# EAGLE design ai_orb-8 (EAGLE 7.1.0)
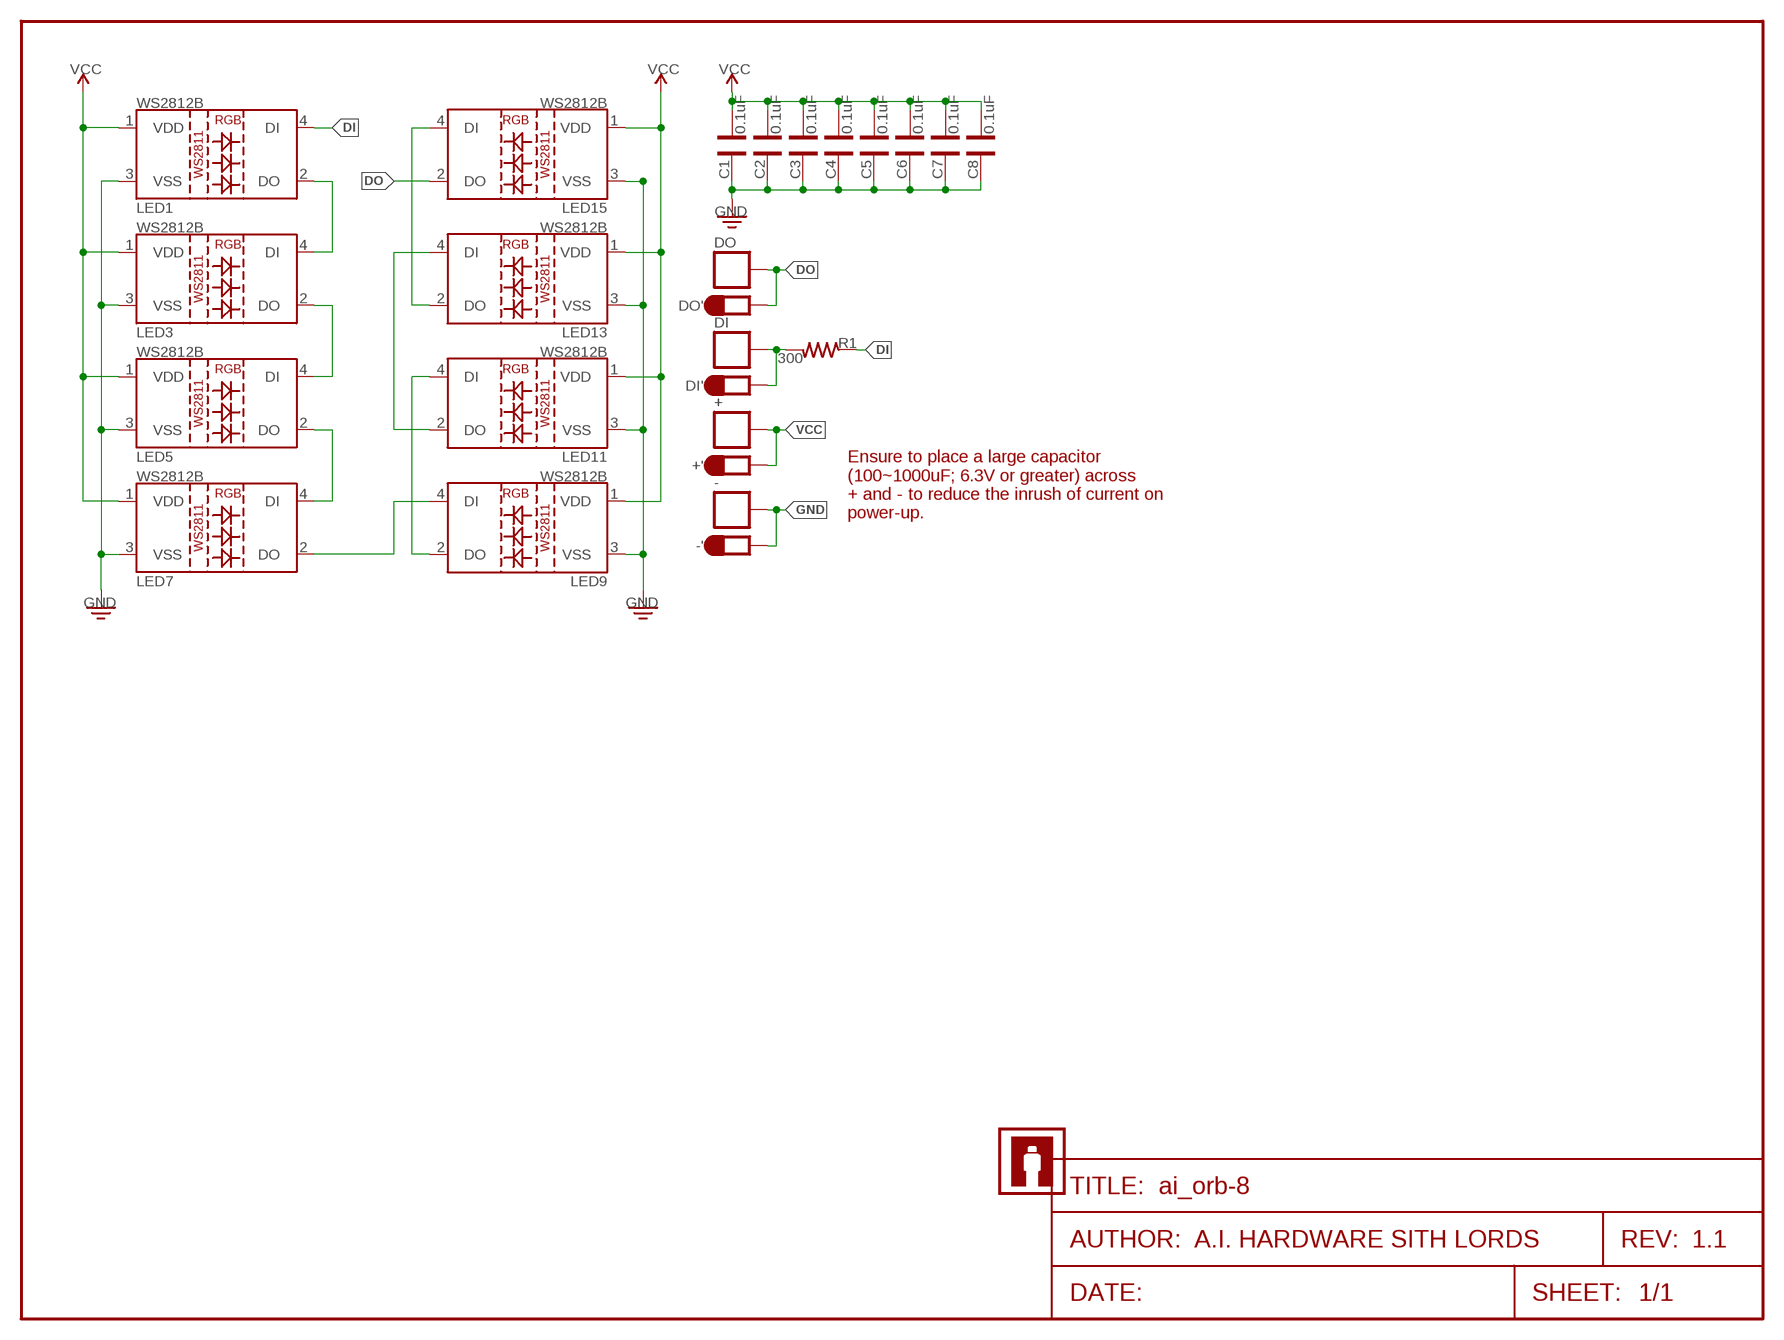
[diagram p0: schematic, sheet 1]
FRAME1 (FRAME-LETTER): AUTHOR: A.I. HARDWARE SITH LORDS; REV: 1.1

## Parts
+  1X01-SM  [1X01-SM]
+'  1X01-PETAL  [1X01-PETAL]
-  1X01-SM  [1X01-SM]
-'  1X01-PETAL  [1X01-PETAL]
C1  0.1uF  CAP0402  [CAP-0402]
C2  0.1uF  CAP0402  [CAP-0402]
C3  0.1uF  CAP0402  [CAP-0402]
C4  0.1uF  CAP0402  [CAP-0402]
C5  0.1uF  CAP0402  [CAP-0402]
C6  0.1uF  CAP0402  [CAP-0402]
C7  0.1uF  CAP0402  [CAP-0402]
C8  0.1uF  CAP0402  [CAP-0402]
DI  1X01-SM  [1X01-SM]
DI'  1X01-PETAL  [1X01-PETAL]
DO  1X01-SM  [1X01-SM]
DO'  1X01-PETAL  [1X01-PETAL]
LED1  LED-WS2812B-SM  [LED-WS2812B-SM]
LED3  LED-WS2812B-SM  [LED-WS2812B-SM]
LED5  LED-WS2812B-SM  [LED-WS2812B-SM]
LED7  LED-WS2812B-SM  [LED-WS2812B-SM]
LED9  LED-WS2812B-SM  [LED-WS2812B-SM]
LED11  LED-WS2812B-SM  [LED-WS2812B-SM]
LED13  LED-WS2812B-SM  [LED-WS2812B-SM]
LED15  LED-WS2812B-SM  [LED-WS2812B-SM]
LOGO  AI-LOGOXS  [AI-LOGO-XS]
LOGO1  AI-LOGOXS  [AI-LOGO-XS]
R1  300  RES0402  [RES-0402]

## Nets
DI: LED1.4(DI) R1.1
DO: DO'.1 DO.1 LED15.2(DO)
GND: -'.1 -.1 C1.2 C2.2 C3.2 C4.2 C5.2 C6.2 C7.2 C8.2 LED1.3(VSS) LED3.3(VSS) LED5.3(VSS) LED7.3(VSS) LED9.3(VSS) LED11.3(VSS) LED13.3(VSS) LED15.3(VSS)
N$1: LED1.2(DO) LED3.4(DI)
N$2: DI'.1 DI.1 R1.2
N$4: LED3.2(DO) LED5.4(DI)
N$6: LED5.2(DO) LED7.4(DI)
N$9: LED7.2(DO) LED9.4(DI)
N$10: LED9.2(DO) LED11.4(DI)
N$13: LED11.2(DO) LED13.4(DI)
N$14: LED13.2(DO) LED15.4(DI)
VCC: +'.1 +.1 C1.1 C2.1 C3.1 C4.1 C5.1 C6.1 C7.1 C8.1 LED1.1(VDD) LED3.1(VDD) LED5.1(VDD) LED7.1(VDD) LED9.1(VDD) LED11.1(VDD) LED13.1(VDD) LED15.1(VDD)

## Notes on the sheet
- Ensure to place a large capacitor
  (100~1000uF; 6.3V or greater) across 
  + and - to reduce the inrush of current on
  power-up.

## Library data of the parts
+ - DI DO = Ai_Connectors:1X01
+' -' DI' DO' = Ai_Connectors:1X01-PETAL
C1-C8 = Ai_Passives:CAP
LED1 LED3 LED5 LED7 LED9 LED11 LED13 LED15 = Ai_LED:LED-WS2812B
LOGO LOGO1 = Ai_Miscellany:AI-LOGO
R1 = Ai_Passives:RES: Part # blah Digikey

## Board
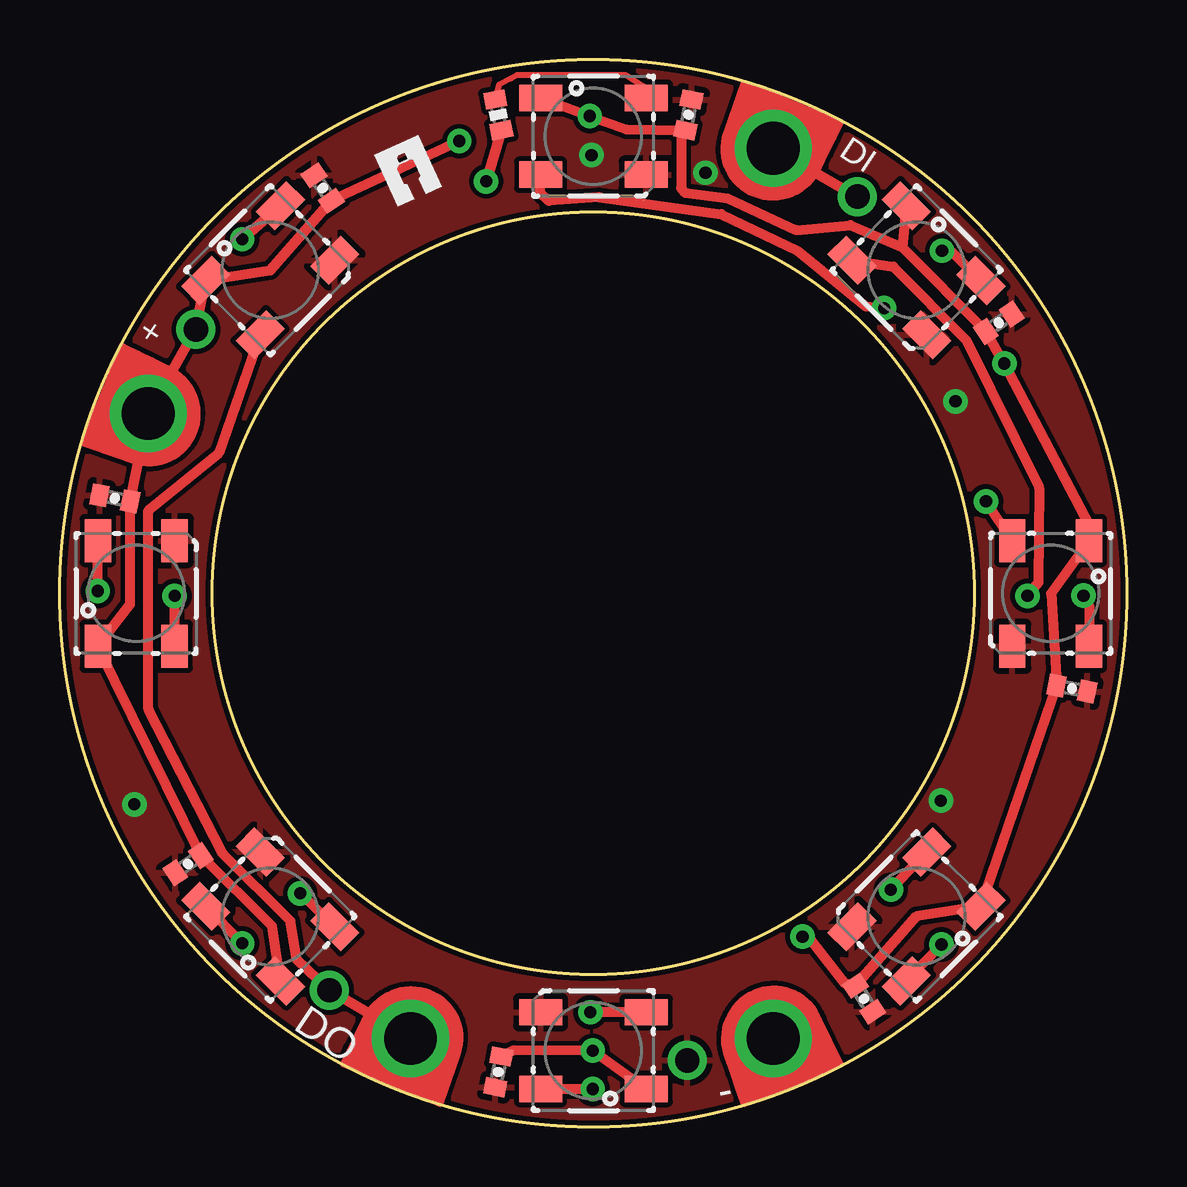
[diagram p1: board, top side]
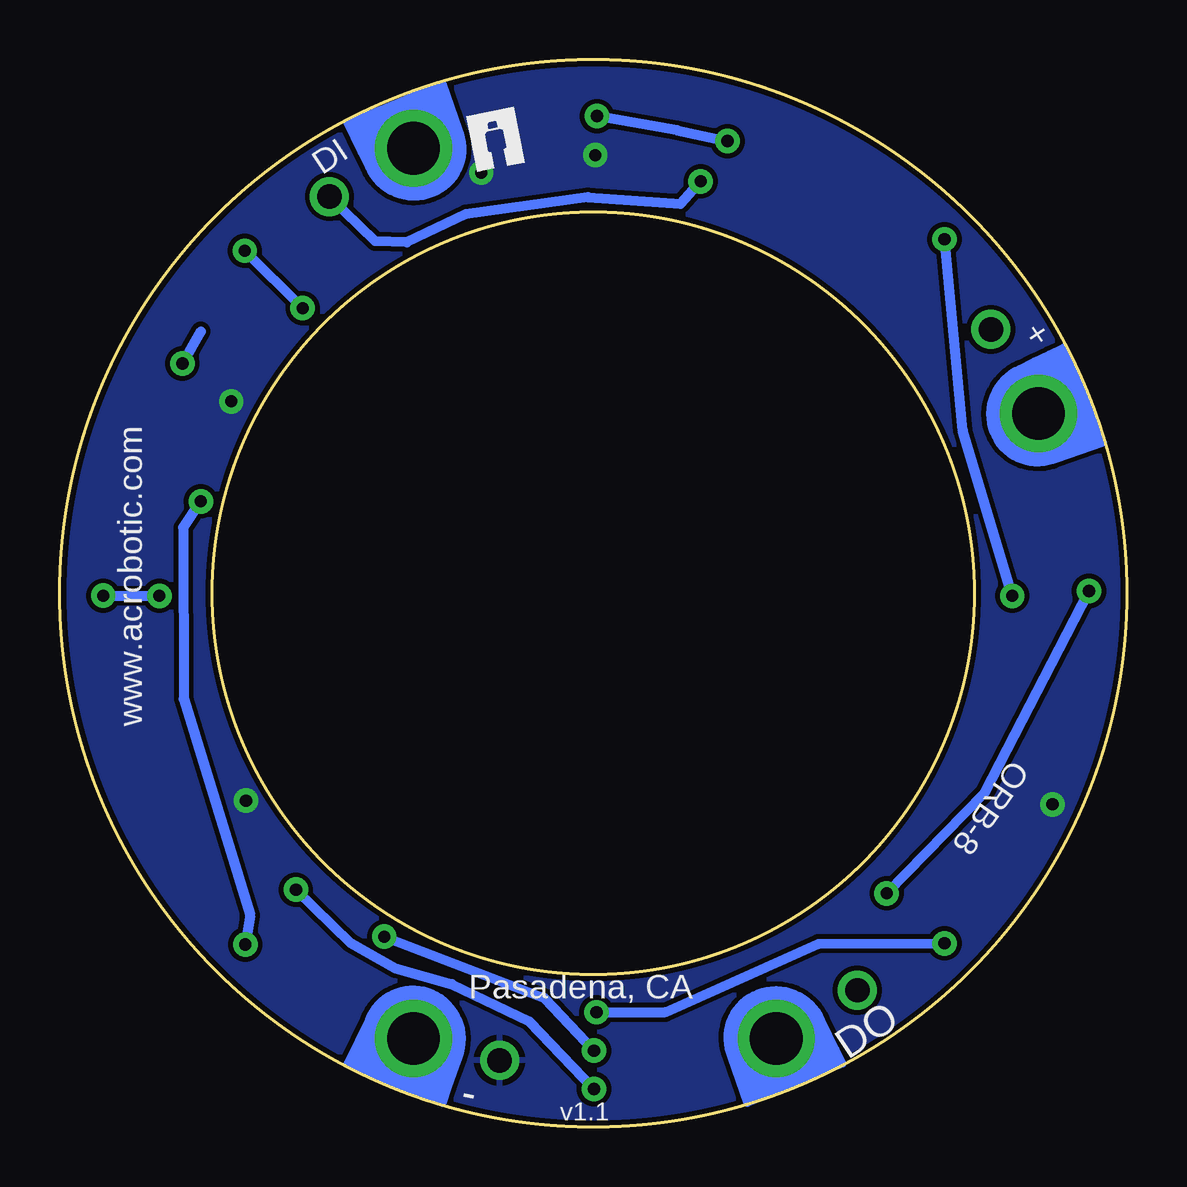
[diagram p2: board, bottom side, seen from below]

Size 44.45 x 44.45 mm. Coordinates in mm from the lower left corner, seen from the top.
Outline: circle at 22.23,22.23 radius 22.23
Outline: circle at 22.23,22.23 radius 15.88
Copper layers (1*16): Top 0.035mm / dielectric 1.5mm / Bottom 0.035mm
Design rules "ai_2layer": minimum track width 7mil, minimum drill 15mil, track to track 8mil, track to pad 8mil, pad to pad 8mil, via to via 8mil, smd to smd 8mil, copper to edge 8mil, drill to drill 8mil, minimum pad ring 12mil, minimum via ring 10mil, stop-mask expansion 4mil, vias tented up to drill 20mil, thermal gap 10mil

### Footprints (pad centres in the part's own frame; a part is rotated, then mirrored left to right if it is on the bottom)
1X01-SM = drill 1.016 pad 1.524: 1 0,0
1X01-PETAL = drill 2.2: 1 0,0
CAP-0402 = smd 0.7 x 0.9: 1 -0.65,0; 2 0.65,0
LED-WS2812B-SM = smd 1.8 x 1.1: 1 -2.2,1.6; 2 -2.2,-1.6; 3 2.2,-1.6; 4 2.2,1.6
RES-0402 = smd 0.7 x 0.9: 1 -0.65,0; 2 0.65,0

### Placement (x,y rotation side)
+  5.66,33.22 0 top
+'  3.68,29.72 67.5 top
-  26.14,2.77 191.3 top
-'  29.72,3.68 202.5 top
C1  26.19,42.16 78.8 top
C2  39.12,33.5 33.8 top
C3  42.16,18.26 348.8 top
C4  33.5,5.33 303.8 top
C5  18.26,2.29 258.8 top
C6  5.33,10.95 213.8 top
C7  2.29,26.19 168.8 top
C8  10.95,39.12 123.8 top
DI  33.22,38.76 0 top
DI'  29.72,40.77 337.5 top
DO  11.23,5.69 0 top
DO'  14.61,3.68 157.5 top
LED1  22.23,41.27 0 top
LED3  35.69,35.69 315 top
LED5  41.27,22.23 270 top
LED7  35.69,8.76 225 top
LED9  22.23,3.17 180 top
LED11  8.76,8.76 135 top
LED13  3.17,22.23 90 top
LED15  8.76,35.69 45 top
LOGO  27.05,39.8 11.2 bottom
LOGO1  14.1,38.35 24.5 top
R1  18.26,42.16 281.3 top

### Tracks (layer width: path | path; a pad name or v marks a point on that pad's centre or on a via)
DI
  Top 0.254: LED1.4 24.28,43.36 23.57,43.81 19.05,43.81 18.8,43.69 18.29,43.41 R1.1
DO
  Top 0.406: DO'.1 DO.1 9.86,6.99 9.6,8.59 6.78,11.38 3.68,17.4 3.68,25.68 6.63,28.09 LED15.2
GND  (via drill 0.51)
  other vias: 26.9,39.75 37.31,30.23 36.7,13.59 3.1,13.44 22.15,40.49
  pour Top: 0,0 0,44.45 44.45,44.45 44.45,0
  pour Bottom: 0,0 0,44.45 44.45,44.45 44.45,0
N$1  (via drill 0.51)
  Top 0.406: v34.34,34.11 33.58,34.19 30.73,36.5 27.56,38.02 22.45,38.73 20.37,38.58 20.02,38.91 LED1.2 | v36.75,36.5 37.13,36.47 LED3.4
  Bottom 0.406: v34.34,34.11 v36.75,36.5
N$2  (via drill 0.51)
  Top 0.406: DI'.1 DI.1 | R1.2 v17.75,39.4
  Bottom 0.406: v17.75,39.4 18.59,38.46 22.45,38.73 27.53,38.02 30,36.85 31.32,36.91 DI.1
N$4  (via drill 0.51)
  Top 0.406: LED3.2 34.72,35.84 37.77,32.77 40.79,26.62 40.77,22.68 v40.31,22.12 | LED5.4 42.9,21.67 v42.65,22.13
  Bottom 0.406: v42.65,22.13 v40.31,22.12
N$6  (via drill 0.51)
  Top 0.406: LED5.2 v38.58,26.06 | v36.73,7.59 LED7.4
  Bottom 0.406: v38.58,26.06 39.32,24.97 39.29,17.83 36.52,8.81 v36.73,7.59
N$9  (via drill 0.51)
  Top 0.406: LED7.2 v34.62,9.88 | v22.2,1.57 LED9.4
  Bottom 0.406: v34.62,9.88 32.36,7.67 30.48,6.6 28.12,5.94 24.89,4.39 v22.2,1.57
N$10  (via drill 0.51)
  Top 0.406: LED9.2 v22.1,4.78 | v7.59,7.64 LED11.4
  Bottom 0.406: v22.1,4.78 19.23,4.78 12.85,7.62 v7.59,7.64
N$13  (via drill 0.51)
  Top 0.406: LED11.2 v10.01,9.73 | v1.57,22.33 LED13.4
  Bottom 0.406: v10.01,9.73 5.92,13.92 v1.57,22.33
N$14  (via drill 0.51)
  Top 0.406: LED13.2 v4.78,22.12 | v7.59,36.98 LED15.4
  Bottom 0.406: v4.78,22.12 6.83,29.01 v7.59,36.98
VCC  (via drill 0.51)
  Top 0.406: v16.64,41.07 C8.1 8.76,35.69 LED15.1 +.1 +'.1 C7.1 2.92,21.77 LED13.1 C6.1 8.84,8.36 LED11.1 | LED9.1 v22.2,3.17 18.9,3.18 C5.1 | LED3.1 35.1,36.65 | 35.1,36.65 C2.1 v39.35,31.8 42.9,25.02 LED5.1 41.3,22.23 C3.1 LED7.1 35.69,8.76 C4.1 32.72,5.97 31.29,7.77 v30.94,7.92 | 35.1,36.65 32.94,37.57 30.68,37.36 27.81,38.68 26.06,38.91 25.88,39.12 25.88,41.35 C1.1 23.6,41.55 v22.07,42.11 LED1.1
  Bottom 0.406: v16.64,41.07 18.75,41.53 v22.07,42.11 | C2.1 v39.35,31.8 | v30.94,7.92 24.26,5.36 v22.2,3.17

### Text on the board
bPlace: DI | + | www.acrobotic.com | ORB-8 | DO | Pasadena, CA | - | v1.1